# EAGLE design cny70 array (EAGLE 7.5.0)
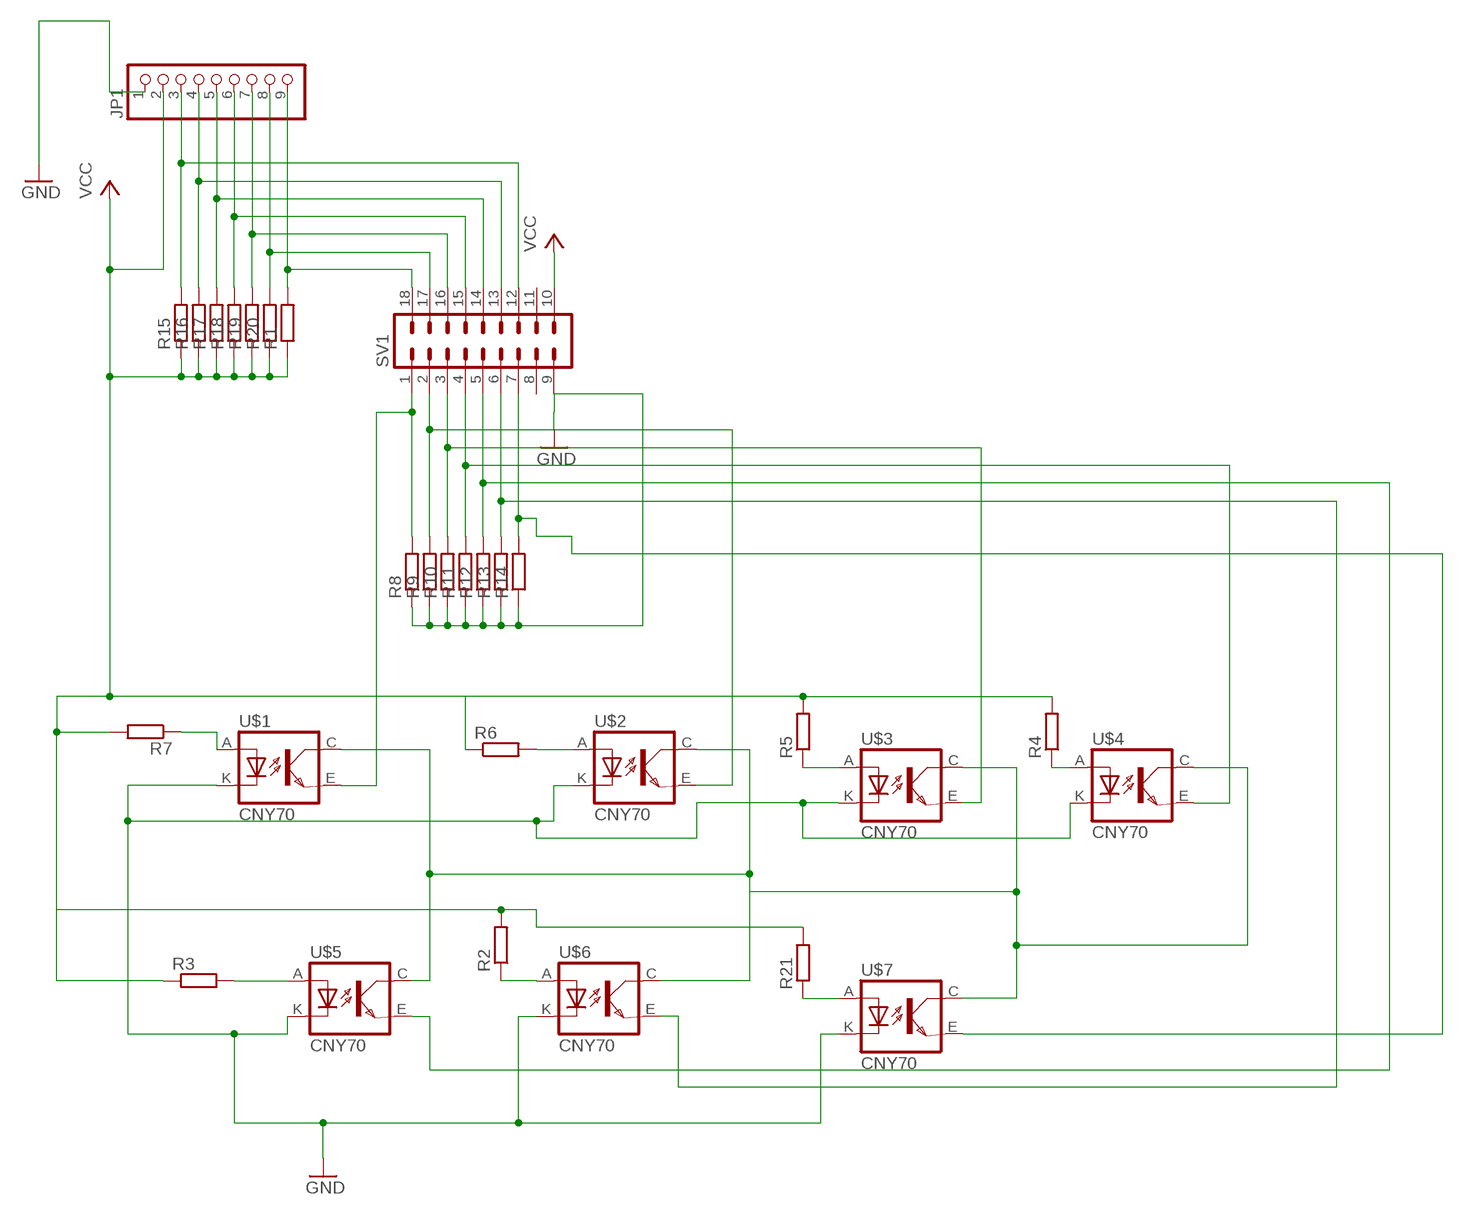
[diagram p0: schematic, sheet 1]

## Parts
JP1  PINHD-1X9  [1X09]
R1  R-EU_0204/5  [0204/5]
R2  R-EU_0204/5  [0204/5]
R3  R-EU_0204/5  [0204/5]
R4  R-EU_0204/5  [0204/5]
R5  R-EU_0204/5  [0204/5]
R6  R-EU_0204/5  [0204/5]
R7  R-EU_0204/5  [0204/5]
R8  R-EU_0204/5  [0204/5]
R9  R-EU_0204/5  [0204/5]
R10  R-EU_0204/5  [0204/5]
R11  R-EU_0204/5  [0204/5]
R12  R-EU_0204/5  [0204/5]
R13  R-EU_0204/5  [0204/5]
R14  R-EU_0204/5  [0204/5]
R15  R-EU_0204/5  [0204/5]
R16  R-EU_0204/5  [0204/5]
R17  R-EU_0204/5  [0204/5]
R18  R-EU_0204/5  [0204/5]
R19  R-EU_0204/5  [0204/5]
R20  R-EU_0204/5  [0204/5]
R21  R-EU_0204/5  [0204/5]
SV1  IC18PL  [IC18PL]
U$1  CNY70  [4]
U$2  CNY70  [4]
U$3  CNY70  [4]
U$4  CNY70  [4]
U$5  CNY70  [4]
U$6  CNY70  [4]
U$7  CNY70  [4]

## Nets
GND: JP1.1 R8.1 R9.1 R10.1 R11.1 R12.1 R13.1 R14.1 SV1.9 U$1.K(C) U$2.K(C) U$3.K(C) U$4.K(C) U$5.K(C) U$6.K(C) U$7.K(C)
N$1: JP1.3 R15.2 SV1.12
N$2: JP1.4 R16.2 SV1.13
N$3: JP1.5 R17.2 SV1.14
N$4: JP1.6 R18.2 SV1.15
N$5: JP1.7 R19.2 SV1.16
N$8: JP1.8 R20.2 SV1.17
N$9: R8.2 SV1.1 U$1.E(EMI)
N$10: R9.2 SV1.2 U$2.E(EMI)
N$11: R10.2 SV1.3 U$3.E(EMI)
N$12: R11.2 SV1.4 U$4.E(EMI)
N$13: R12.2 SV1.5 U$5.E(EMI)
N$14: R13.2 SV1.6 U$6.E(EMI)
N$15: R14.2 SV1.7 U$7.E(EMI)
N$19: R2.1 U$6.A
N$20: R21.1 U$7.A
N$21: U$1.C(COL) U$2.C(COL) U$3.C(COL) U$4.C(COL) U$5.C(COL) U$6.C(COL) U$7.C(COL)
N$22: R4.1 U$4.A
N$23: R5.1 U$3.A
N$24: R6.2 U$2.A
N$25: R7.1 U$1.A
N$26: R3.2 U$5.A
N$27: JP1.9 R1.2 SV1.18
VCC: JP1.2 R1.1 R2.2 R3.1 R4.2 R5.2 R6.1 R7.2 R15.1 R16.1 R17.1 R18.1 R19.1 R20.1 R21.2 SV1.10
Unconnected: SV1.8 SV1.11

## Library data of the parts
JP1 = pinhead:PINHD-1X9: PIN HEADER
R1-R21 = resistor:R-EU_: RESISTOR, European symbol
SV1 = con-dil:IC18PL: DIL CABLE CONNECTOR
U$1-U$7 = cny70:CNY70

## Board
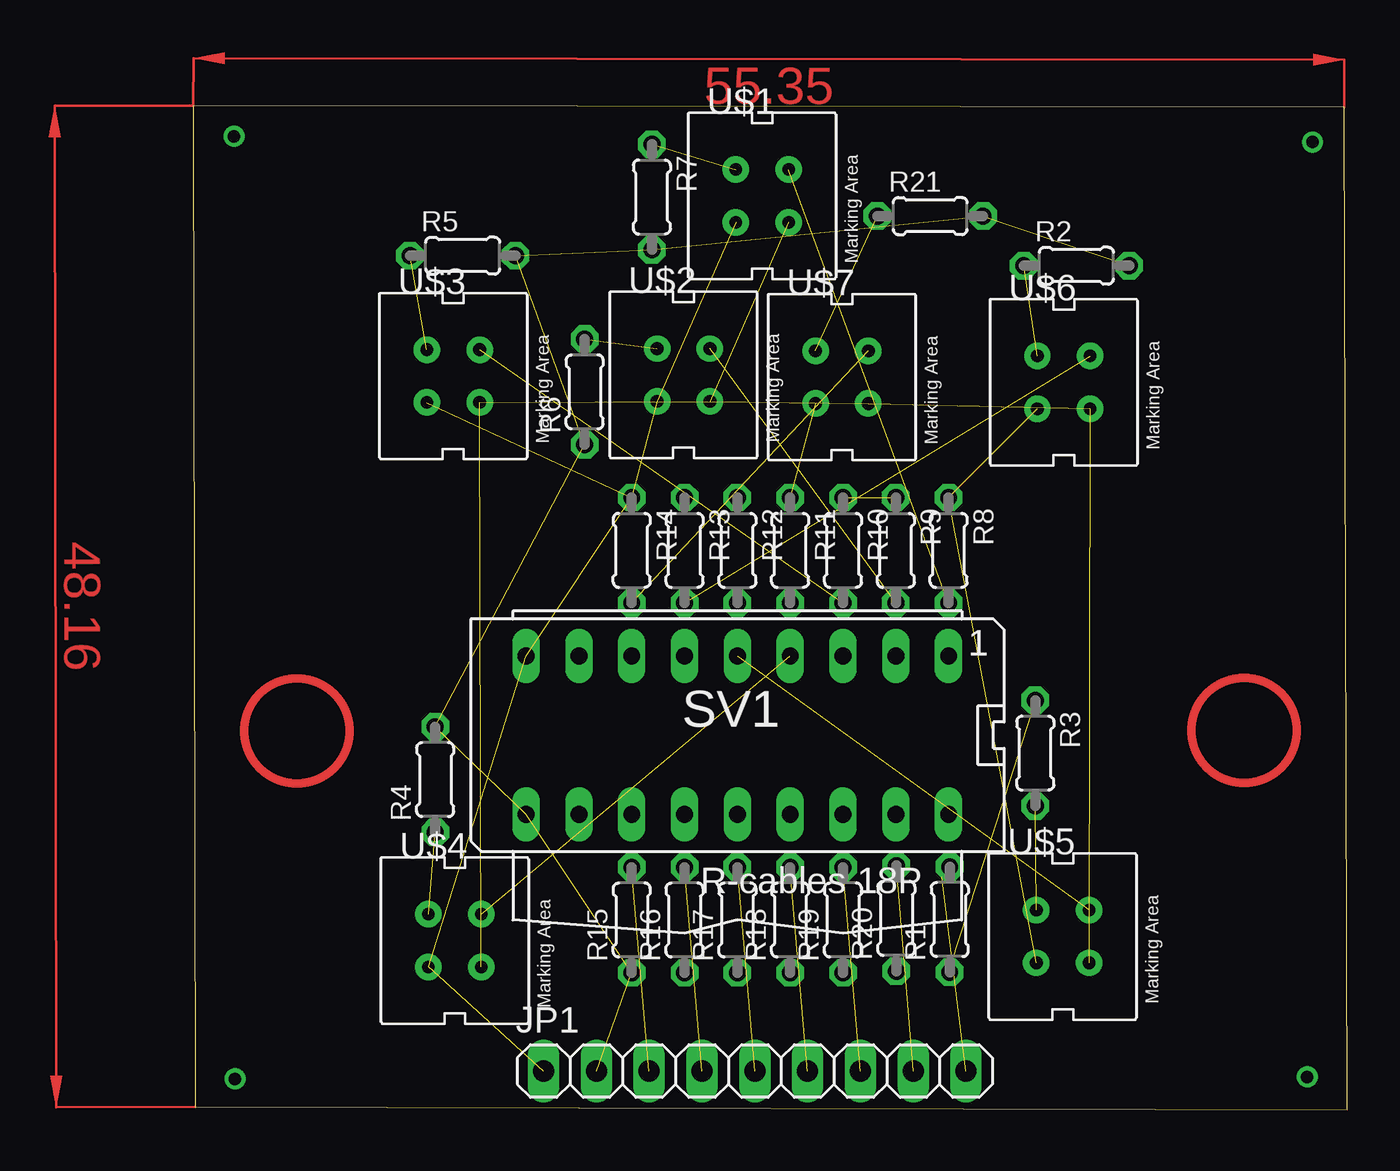
[diagram p1: board, top side]
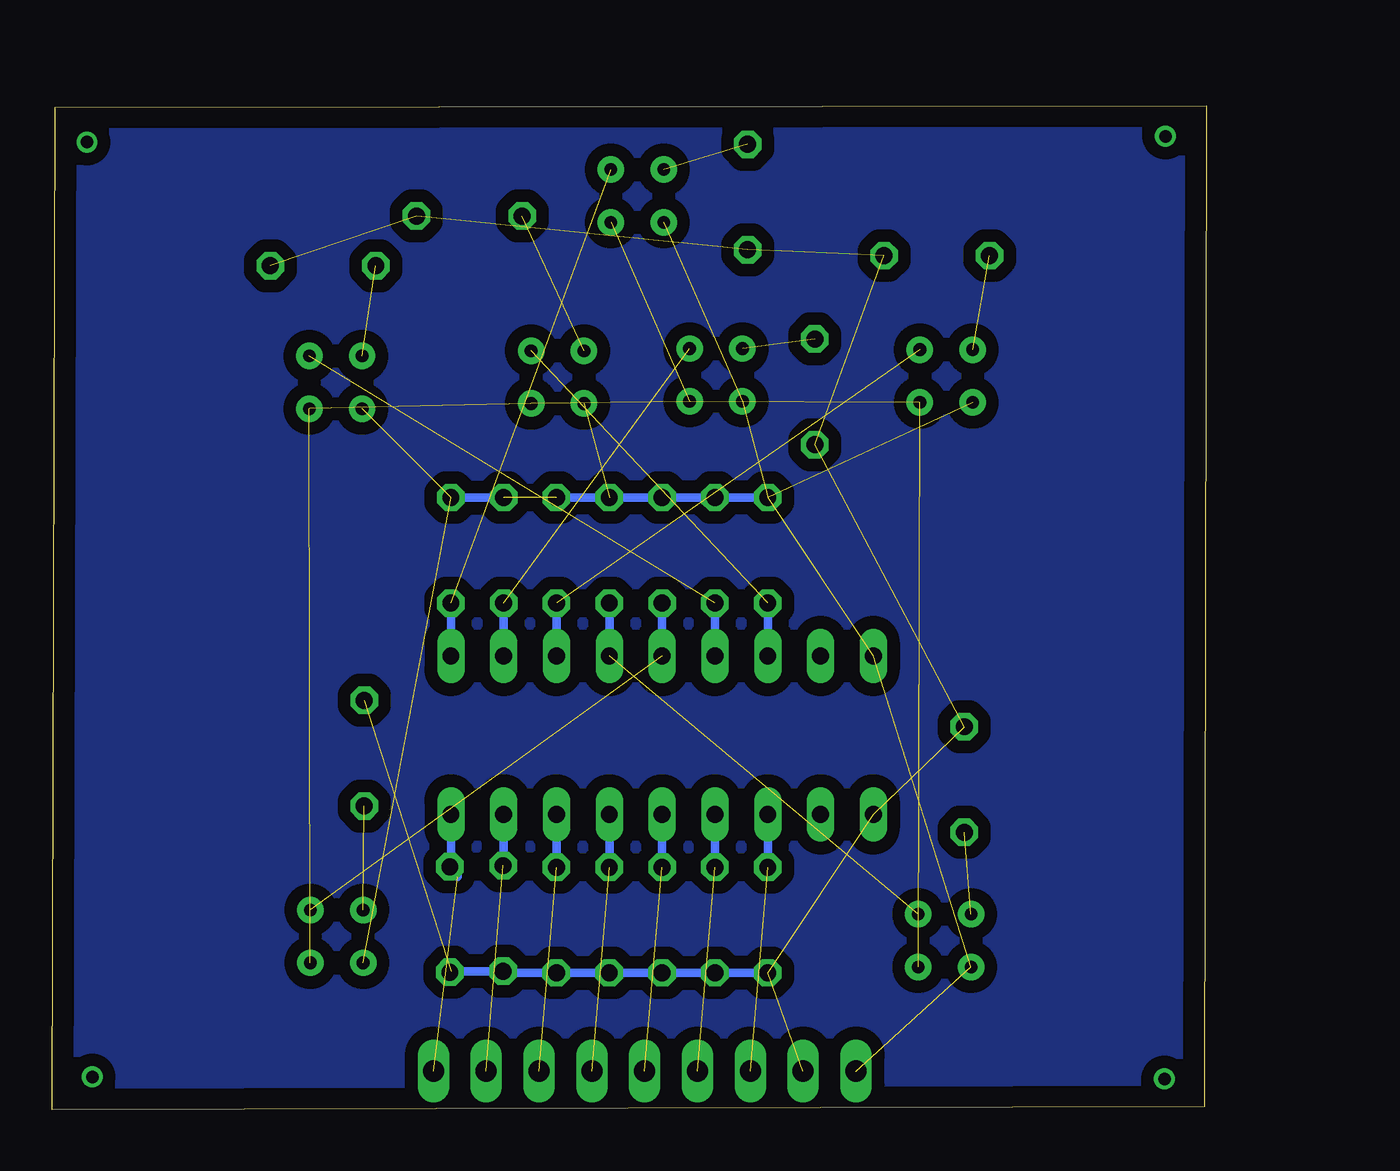
[diagram p2: board, bottom side, seen from below]

Size 55.5 x 48.29 mm. Coordinates in mm from the lower left corner, seen from the top.
Outline: 0.08,0.13 55.5,0 55.35,48.21 0,48.29 0.08,0.13
Copper layers (1*16): Top 0.035mm / dielectric 1.5mm / Bottom 0.035mm
Design rules "default": minimum track width 10mil, minimum drill 24mil, track to track 8mil, track to pad 8mil, pad to pad 8mil, via to via 8mil, smd to smd 8mil, copper to edge 40mil, drill to drill 8mil, minimum pad ring 10mil, minimum via ring 8mil, stop-mask expansion 4mil, vias tented up to drill 0mil, thermal gap 10mil

### Footprints (pad centres in the part's own frame; a part is rotated, then mirrored left to right if it is on the bottom)
1X09 = drill 1.016 long: 1 -10.16,0; 2 -7.62,0; 3 -5.08,0; 4 -2.54,0; 5 0,0; 6 2.54,0; 7 5.08,0; 8 7.62,0; 9 10.16,0
0204/5 = drill 0.813 octagon: 1 -2.54,0; 2 2.54,0
IC18PL = drill 0.813 long: 1 -10.16,-3.81; 2 -7.62,-3.81; 3 -5.08,-3.81; 4 -2.54,-3.81; 5 0,-3.81; 6 2.54,-3.81; 7 5.08,-3.81; 8 7.62,-3.81; 9 10.16,-3.81; 10 10.16,3.81; 11 7.62,3.81; 12 5.08,3.81; 13 2.54,3.81; 14 0,3.81; 15 -2.54,3.81; 16 -5.08,3.81; 17 -7.62,3.81; 18 -10.16,3.81
4 = drill 0.61 pad 1.27: A -1.27,1.27; C 1.27,-1.27; E 1.27,1.27; K -1.27,-1.27

### Placement (x,y rotation side)
JP1  27,1.85 0 top
R1  36.37,9.14 90 top
R2  42.47,40.59 0 top
R3  40.49,17.14 270 top
R4  11.63,15.88 90 top
R5  12.95,41.07 0 top
R6  18.82,34.52 90 top
R7  22.05,43.89 270 top
R8  36.32,26.9 270 top
R9  33.78,26.9 270 top
R10  31.24,26.9 270 top
R11  28.7,26.9 270 top
R12  26.16,26.9 270 top
R13  23.62,26.9 270 top
R14  21.08,26.9 270 top
R15  21.08,9.12 90 top
R16  23.62,9.12 90 top
R17  26.16,9.12 90 top
R18  28.7,9.12 90 top
R19  31.24,9.12 90 top
R20  33.81,9.19 90 top
R21  35.43,42.98 0 top
SV1  26.16,18.01 180 top
U$1  27.36,43.94 0 top
U$2  23.57,35.33 0 top
U$3  12.5,35.28 0 top
U$4  12.57,8.13 0 top
U$5  41.81,8.33 0 top
U$6  41.86,34.98 0 top
U$7  31.19,35.23 0 top

### Tracks (layer width: path | path; a pad name or v marks a point on that pad's centre or on a via)
GND  (10 unrouted)
  Bottom 0.406: R14.1 R13.1 R12.1 R11.1 R10.1 | R8.1 R9.1
N$1  (1 unrouted)
  Bottom 0.406: SV1.12 R15.2
N$2  (1 unrouted)
  Bottom 0.406: SV1.13 R16.2
N$3  (1 unrouted)
  Bottom 0.406: SV1.14 R17.2
N$4  (1 unrouted)
  Bottom 0.406: SV1.15 R18.2
N$5  (1 unrouted)
  Bottom 0.406: SV1.16 R19.2
N$6  (via drill 0.6)
  other vias: 1.96,46.81
N$7
  pour Bottom (isolate 0.61): 0.05,0.05 -0.15,0.05 -0.15,48.44 55.63,48.44 55.63,-0.15 0.18,-0.15 0.18,0.18
N$8  (1 unrouted)
  Bottom 0.406: SV1.17 33.78,11.76 R20.2
N$9  (1 unrouted)
  Bottom 0.406: SV1.1 R8.2
N$10  (1 unrouted)
  Bottom 0.406: R9.2 SV1.2
N$11  (1 unrouted)
  Bottom 0.406: SV1.3 R10.2
N$12  (1 unrouted)
  Bottom 0.406: SV1.4 R11.2
N$13  (1 unrouted)
  Bottom 0.406: SV1.5 R12.2
N$14  (1 unrouted)
  Bottom 0.406: SV1.6 R13.2
N$15  (1 unrouted)
  Bottom 0.406: SV1.7 R14.2
N$16  (via drill 0.6)
  other vias: 53.82,46.53
N$17  (via drill 0.6)
  other vias: 2.01,1.47
N$18  (via drill 0.6)
  other vias: 53.57,1.57
N$19  (1 unrouted)
N$20  (1 unrouted)
N$21  (6 unrouted)
N$22  (1 unrouted)
N$23  (1 unrouted)
N$24  (1 unrouted)
N$25  (1 unrouted)
N$26  (1 unrouted)
N$27  (1 unrouted)
  Bottom 0.406: SV1.18 36.32,11.53 35.99,11.2 35.99,11.3 R1.2
VCC  (9 unrouted)
  Bottom 0.406: R15.1 R16.1 R17.1 R18.1 R19.1 33.53,6.58 R20.1 36.32,6.66 R1.1
(copper drawn outside any net)
  shapes: Top area x3, Top circle x3